# Altium schematic sheet 16_IO_LVDS.SchDoc
size A3; DocumentNumber: 16; SheetNumber: 16; SheetTotal: 21
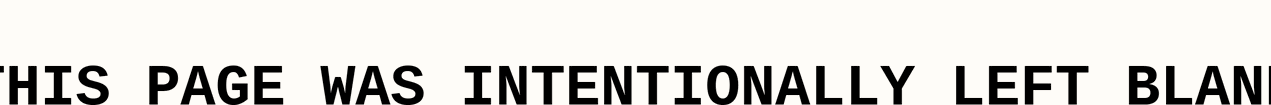
[diagram p0: 16_IO_LVDS.SchDoc]

## Notes on the sheet
- THIS PAGE WAS INTENTIONALLY LEFT BLANK